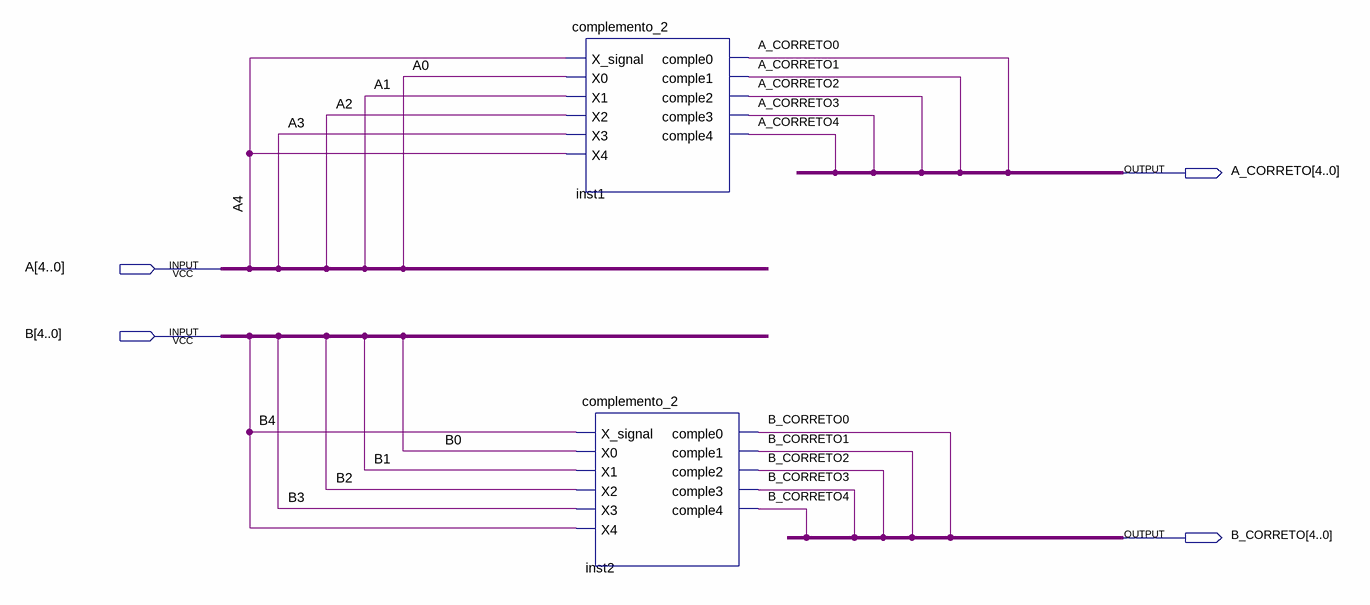
[diagram p0: schematic sheet]
// Quartus schematic prior_comp.bdf as structural Verilog: 2 symbols, 4 pins
module prior_comp (
  input  [4:0] A,
  input  [4:0] B,
  output [4:0] A_CORRETO,
  output [4:0] B_CORRETO
);

  complemento_2 inst1 (
    .X_signal(A[4]), .X0(A[0]), .X1(A[1]), .X2(A[2]), .X3(A[3]), .X4(A[4]), .comple0(A_CORRETO[0]),
    .comple1(A_CORRETO[1]), .comple2(A_CORRETO[2]), .comple3(A_CORRETO[3]), .comple4(A_CORRETO[4]));
  complemento_2 inst2 (
    .X_signal(B[4]), .X0(B[0]), .X1(B[1]), .X2(B[2]), .X3(B[3]), .X4(B[4]), .comple0(B_CORRETO[0]),
    .comple1(B_CORRETO[1]), .comple2(B_CORRETO[2]), .comple3(B_CORRETO[3]), .comple4(B_CORRETO[4]));
endmodule
